# Altium schematic sheet 1_MCU.SchDoc
size A4
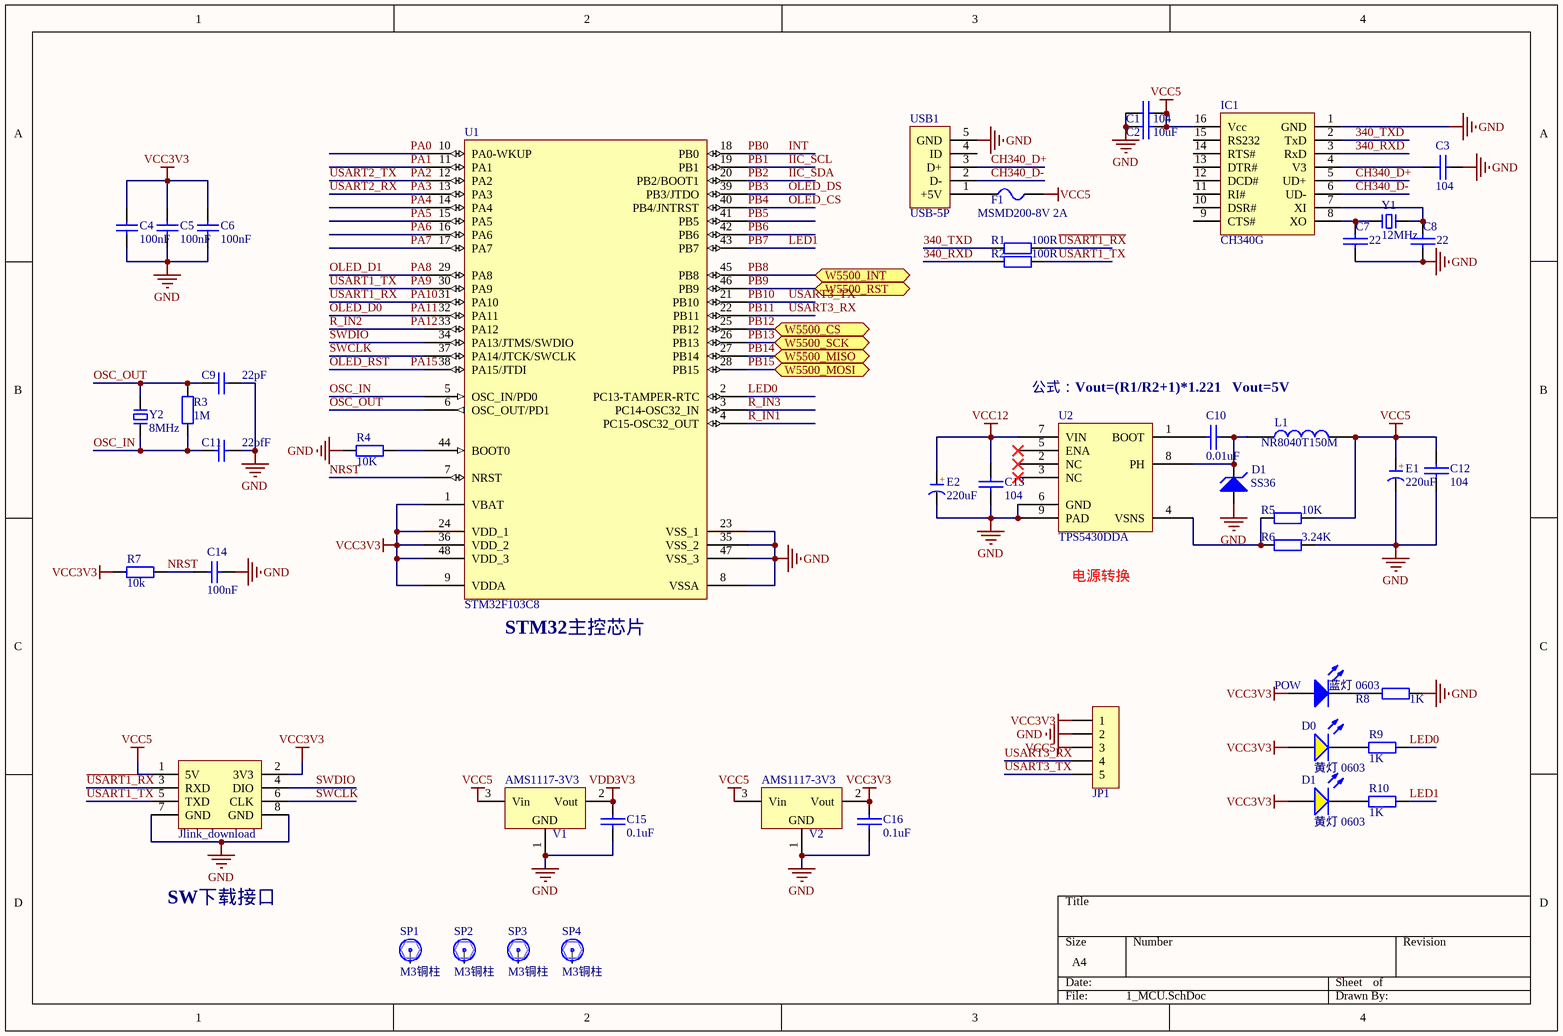
[diagram p0: 1_MCU.SchDoc]

## Parts
(Parts that share a designator on the sheet are numbered #1, #2 ... from top to bottom, then left to right.)
*1  Jlink_download  [HDR2.54-M-LI-2x4P]
C1  104  [LC-0603_C]
C2  10uF  [LC-0805_C]
C3  104  [LC-0603_C]
C4  100nF  [LC-0603_C]
C5  100nF  [LC-0603_C]
C6  100nF  [LC-0603_C]
C7  22  [LC-0603_C]
C8  22  [LC-0603_C]
C9  22pF  [LC-0603_C]
C10  0.01uF  [LC-0603_C]
C11  22pfF  [LC-0603_C]
C12  104  [LC-0603_C]
C13  104  [LC-0603_C]
C14  100nF  [LC-0603_C]
C15  0.1uF  [LC-0603_C]
C16  0.1uF  [LC-0603_C]
D0  黄灯 0603  [LC-0603_LED_S1]
D1#1  SS36  [D1812]
D1#2  黄灯 0603  [LC-0603_LED_S1]
E1  220uF  [CM E(8*10.2)]
E2  220uF  [CM E(8*10.2)]
F1  MSMD200-8V 2A  [FU 0805]
IC1  CH340G  [SOP16_M]
JP1  HDR-1X5  [HDR2.54-LI-5P]  (value not drawn)
L1  NR8040T150M  [NR8040]
POW  蓝灯 0603  [LC-0603_LED_S1]
R1  100R  [LC-0603_R]
R2  100R  [LC-0603_R]
R3  1M  [LC-0603_R]
R4  10K  [LC-0603_R]
R5  10K  [LC-0603_R]
R6  3.24K  [LC-0603_R]
R7  10k  [LC-0603_R]
R8  1K  [LC-0603_R]
R9  1K  [LC-0603_R]
R10  1K  [LC-0603_R]
SP1  M3铜柱  [M3x6_N]
SP2  M3铜柱  [M3x6_N]
SP3  M3铜柱  [M3x6_N]
SP4  M3铜柱  [M3x6_N]
U1  STM32F103C8  [LQFP48 7X7_M]
U2  TPS5430DDA  [SO-G8]
USB1  USB-5P  [USB-MICRO_A]
V1  AMS1117-3V3  [SOT223_N]
V2  AMS1117-3V3  [SOT223_N]
Y1  12MHz  [OSC HC-49S]
Y2  8MHz  [OSC HC-49S]

## Ports
W5500_CS, W5500_INT, W5500_MISO, W5500_MOSI, W5500_RST, W5500_SCK

## Nets
GND: *1.7(GND) *1.8(GND) C1.2 C2.2 C3.2 C4.2 C5.2 C6.2 C7.2 C8.2 C9.2 C11.2 C12.2 C13.2 C14.2 C15.1 C16.1 D1#1.1(A) E1.2(K) E2.2(K) IC1.1(GND) JP1.2 R4.2 R6.1 R8.1 U1.8(VSSA) U1.23(VSS_1) U1.35(VSS_2) U1.47(VSS_3) U2.6(GND) U2.9(PAD) USB1.5(GND) V1.1(GND) V2.1(GND)
VCC3V3: *1.2(3V3) C4.1 C5.1 C6.1 C16.2 D0.A D1#2.A JP1.1 POW.A R7.1 U1.1(VBAT) U1.9(VDDA) U1.24(VDD_1) U1.36(VDD_2) U1.48(VDD_3) V2.2(Vout)
VCC5: *1.1(5V) C1.1 C2.1 C12.1 E1.1(A) F1.2 IC1.16(Vcc) JP1.3 L1.2 R5.1 V1.3(Vin) V2.3(Vin)
VCC12: C13.1 E2.1(A) U2.7(VIN)
VDD3V3: C15.2 V1.2(Vout)
340_RXD: IC1.3(RxD) R2.2
340_TXD: IC1.2(TxD) R1.2
~{USART1_RX}: *1.3(RXD) R1.1 U1.31(PA10)  [also labelled PA10]
CH340_D+: IC1.5(UD+) USB1.3(D+)
CH340_D-: IC1.6(UD-) USB1.2(D-)
IIC_SCL: U1.19(PB1)  [also labelled PB1]
IIC_SDA: U1.20(PB2/BOOT1)  [also labelled PB2]
INT: U1.18(PB0)  [also labelled PB0]
LED0: R9.2 U1.2(PC13-TAMPER-RTC)
LED1: R10.2 U1.43(PB7)  [also labelled PB7]
NRST: C14.1 R7.2 U1.7(NRST)
OLED_CS: U1.40(PB4/JNTRST)  [also labelled PB4]
OLED_D0: U1.32(PA11)  [also labelled PA11]
OLED_D1: U1.29(PA8)  [also labelled PA8]
OLED_DS: U1.39(PB3/JTDO)  [also labelled PB3]
OLED_RST: U1.38(PA15/JTDI)  [also labelled PA15]
OSC_IN: C11.1 R3.1 U1.5(OSC_IN/PD0) Y2.1
OSC_OUT: C9.1 R3.2 U1.6(OSC_OUT/PD1) Y2.2
PA0: U1.10(PA0-WKUP)
PA1: U1.11(PA1)
PA2: U1.12(PA2)  [also labelled USART2_TX]
PA3: U1.13(PA3)  [also labelled USART2_RX]
PA4: U1.14(PA4)
PA5: U1.15(PA5)
PA6: U1.16(PA6)
PA7: U1.17(PA7)
PA9: *1.5(TXD) R2.1 U1.30(PA9)  [also labelled USART1_TX]
PA12: U1.33(PA12)  [also labelled R_IN2]
PB5: U1.41(PB5)
PB6: U1.42(PB6)
PB8: U1.45(PB8) ; port W5500_INT
PB9: U1.46(PB9) ; port W5500_RST
PB10: JP1.5 U1.21(PB10)  [also labelled USART3_TX]
PB11: JP1.4 U1.22(PB11)  [also labelled USART3_RX]
PB12: U1.25(PB12) ; port W5500_CS
PB13: U1.26(PB13) ; port W5500_SCK
PB14: U1.27(PB14) ; port W5500_MISO
PB15: U1.28(PB15) ; port W5500_MOSI
R_IN1: U1.4(PC15-OSC32_OUT)
R_IN3: U1.3(PC14-OSC32_IN)
SWCLK: *1.6(CLK) U1.37(PA14/JTCK/SWCLK)
SWDIO: *1.4(DIO) U1.34(PA13/JTMS/SWDIO)
NetC3_1: C3.1 IC1.4(V3)
NetC7_1: C7.1 IC1.8(XO) Y1.1
NetC8_1: C8.1 IC1.7(XI) Y1.2
NetC10_1: C10.1 D1#1.2(K) L1.1 U2.8(PH)
NetC10_2: C10.2 U2.1(BOOT)
NetD0_K: D0.K R9.1
NetD1#2_K: D1#2.K R10.1
NetF1_1: F1.1 USB1.1(+5V)
NetPOW_K: POW.K R8.2
NetR4_1: R4.1 U1.44(BOOT0)
NetR5_2: R5.2 R6.2 U2.4(VSNS)

Not connected (* = marked no-connect by the designer): IC1 9(CTS#) 10(DSR#) 11(RI#) 12(DCD#) 13(DTR#) 14(RTS#) 15(RS232); SP1 1; SP2 1; SP3 1; SP4 1; U2 2(NC)* 3(NC)* 5(ENA)*; USB1 4(ID)

## Notes on the sheet
- 公式：Vout=(R1/R2+1)*1.221   Vout=5V
- (near U2) 电源转换
- (near U1) STM32主控芯片
- SW下载接口
- (in symbol C-CM) +

## Library data of the parts
*1 = Jlink_下载器: Jlink下载器
C1-C3 C7 C8 C10 C12 C13 C15 C16 = 0805C: Capacitor 0805
C4-C6 C9 C11 C14 = Cap: 无极性电容; Published: 8-Jun-2000; LatestRevisionDate: 17-Jul-2002; LatestRevisionNote: Re-released for DXP Platform.; PackageReference: RAD-0.3; Publisher: Altium Limited
D0 D1#2 = 0603 黄灯: 发光二极管; ComponentLink1Description: 供应商链接; ComponentLink1URL: http://www.szlcsc.com/product/details_73147.html; Package: 0603; Supplier: LC; SuppliersPartNumber: C72038
D1#1 = SS36: Zener Diode
E1 E2 = C-CM: 贴片电解电容; 版权归属: 源创客; BOM名称: 贴片电解电容; 学习资源: www.ooocke.com
F1 = FU: 贴片保险丝; 版权归属: 源创客; BOM名称: 贴片保险丝; 学习资源: www.ooocke.com
IC1 = CH340G: 串口转USB; 版权归属: 源创客; BOM名称: 串口转USB; 学习资源: www.ooocke.com
JP1 = Header 5: 5P接插件; 版权归属: 源创客; BOM名称: 5P接插件; 学习资源: www.ooocke.com
L1 = INDUCTOR
POW = 0603 蓝灯: 发光二极管; ComponentLink1Description: 供应商链接; ComponentLink1URL: http://www.szlcsc.com/product/details_73150.html; Package: 0603; Supplier: LC; SuppliersPartNumber: C72041
R1-R7 = Res1: 贴片电阻; Value: 1K; Published: 8-Jun-2000; LatestRevisionDate: 17-Jul-2002; LatestRevisionNote: Re-released for DXP Platform.; PackageReference: AXIAL-0.4; Publisher: Altium Limited
R8-R10 = Res1: 贴片电阻; Published: 8-Jun-2000; LatestRevisionDate: 17-Jul-2002; LatestRevisionNote: Re-released for DXP Platform.; PackageReference: AXIAL-0.4; Publisher: Altium Limited; Value: 1K
SP1-SP4 = 铜柱大焊盘: 铜柱; 版权归属: 源创客; BOM名称: 铜柱; 学习资源: www.ooocke.com
U1 = STM32F103C8: Flaah:64/RAM:20/IO:36; BOM名称: 32位STM单片机; 版权归属: 源创客; 学习资源: www.ooocke.com
USB1 = USB-5P: 微型USB母座; 版权归属: 源创客; BOM名称: 微型USB母座; 学习资源: www.ooocke.com
V1 V2 = AMS1117: 三端稳压芯片; BOM名称: 稳压芯片; 版权归属: 源创客; 学习资源: www.ooocke.com
Y1 Y2 = XTAL-2P: 2脚无源脚晶振; 版权归属: 源创客; BOM名称: 2脚无源脚晶振; 学习资源: www.ooocke.com